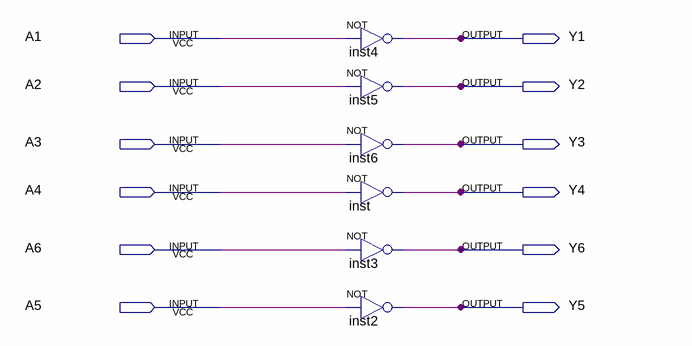
[diagram p0: schematic sheet]
// Quartus schematic ci7404.bdf as structural Verilog: 6 symbols, 12 pins
module ci7404 (
  input  A1,
  input  A2,
  input  A3,
  input  A4,
  input  A6,
  input  A5,
  output Y1,
  output Y2,
  output Y3,
  output Y4,
  output Y6,
  output Y5
);

  not inst4 (Y1, A1);
  not inst5 (Y2, A2);
  not inst6 (Y3, A3);
  not inst (Y4, A4);
  not inst3 (Y6, A6);
  not inst2 (Y5, A5);
endmodule
